# EAGLE design usb-conn (EAGLE 8.3.1)
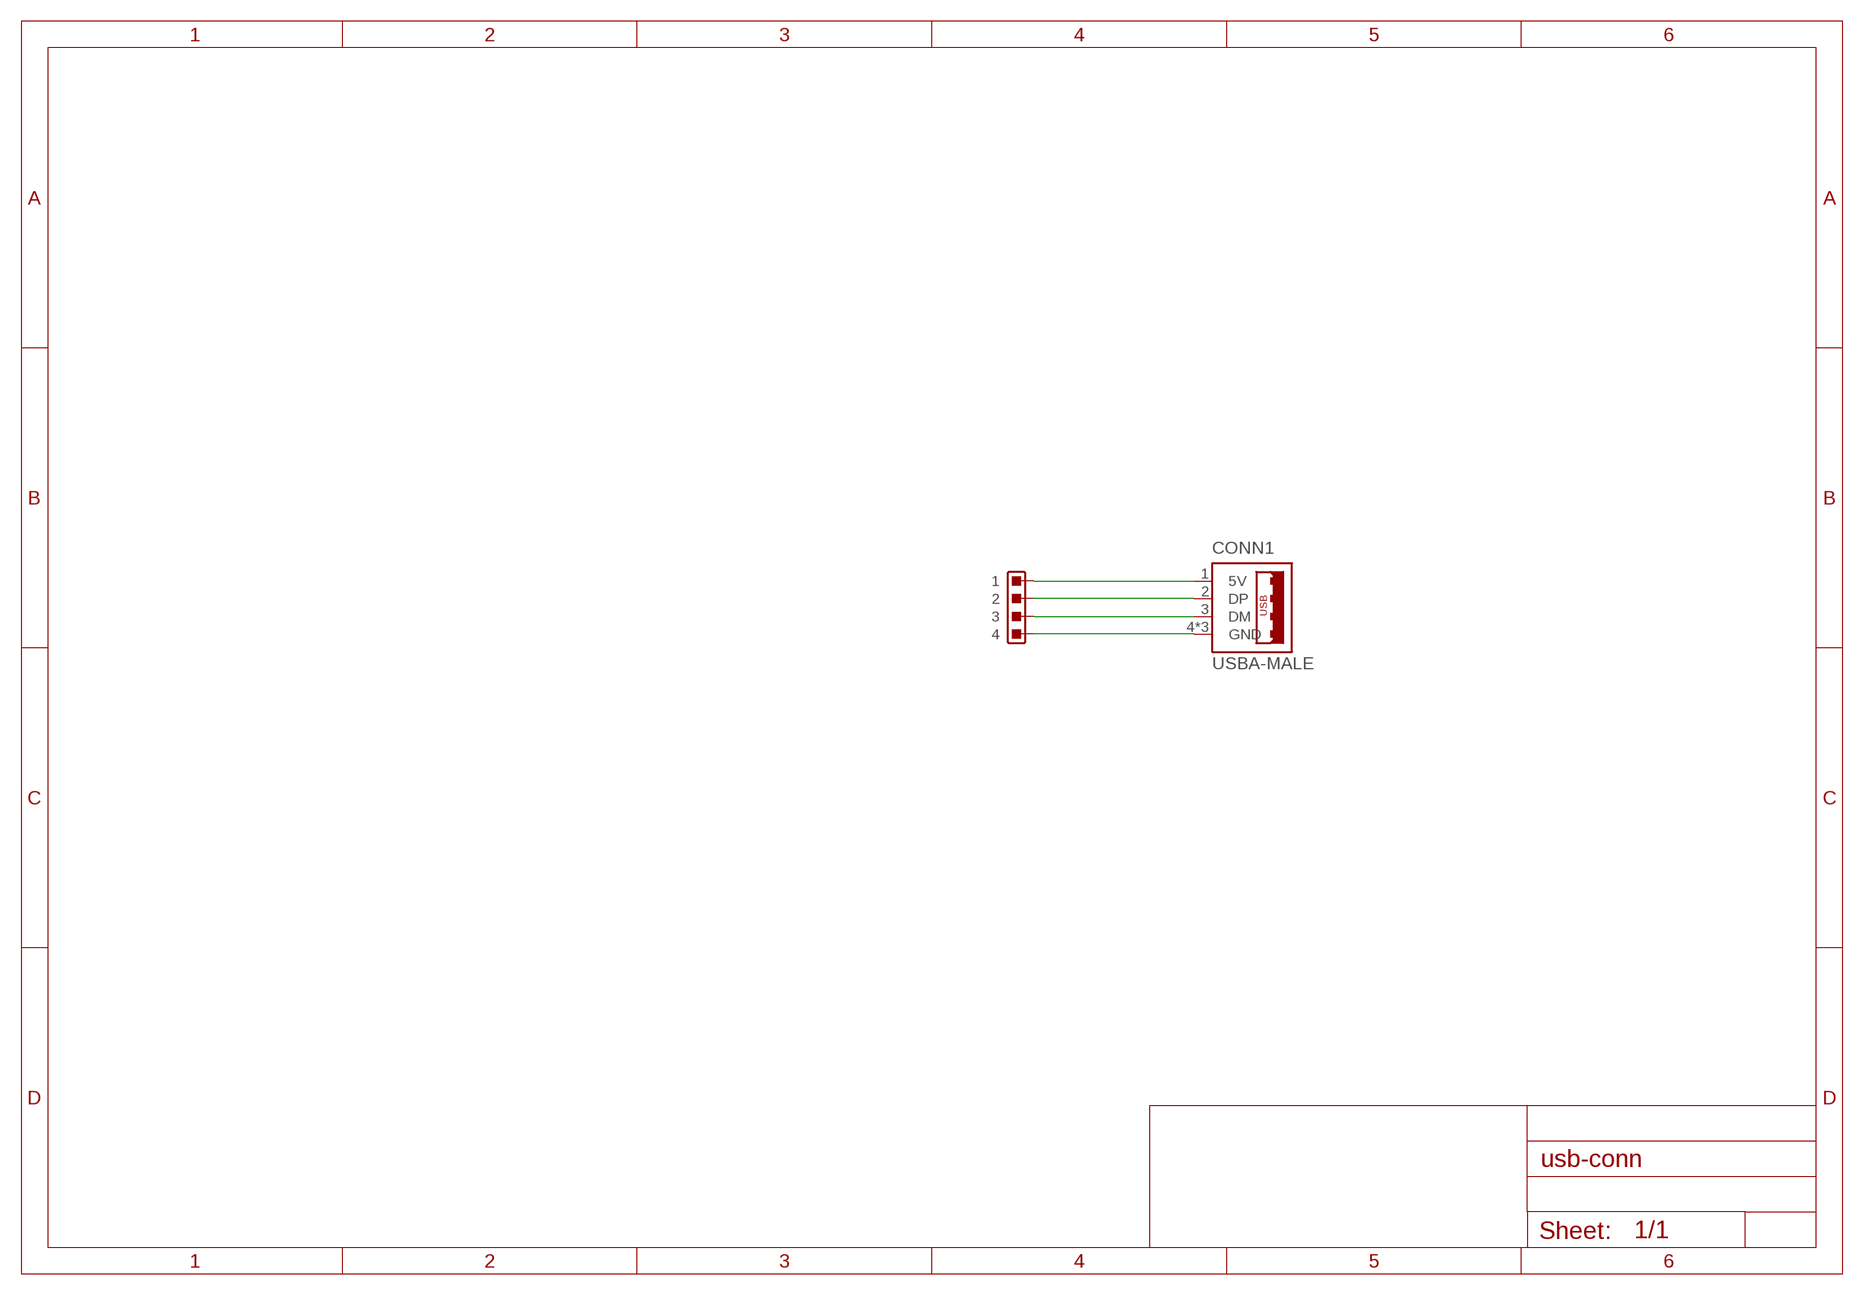
[diagram p0: schematic, sheet 1]

## Parts
CONN1  USBA-MALE  [USBA-MALE]
U$1  4PINCONNMALE  [4PINCONN-MALE]

## Nets
5V: CONN1.1(5V) U$1.1@1 U$1.1@2
DM: CONN1.3(DM) U$1.3@1 U$1.3@2
DP: CONN1.2(DP) U$1.2@1 U$1.2@2
GND: CONN1.4(GND) CONN1.GND$1(GND) CONN1.GND$2(GND) U$1.4@1 U$1.4@2

## Library data of the parts
CONN1 = tuetuopay:USBA-MALE
U$1 = tuetuopay:4PINCONN

## Board
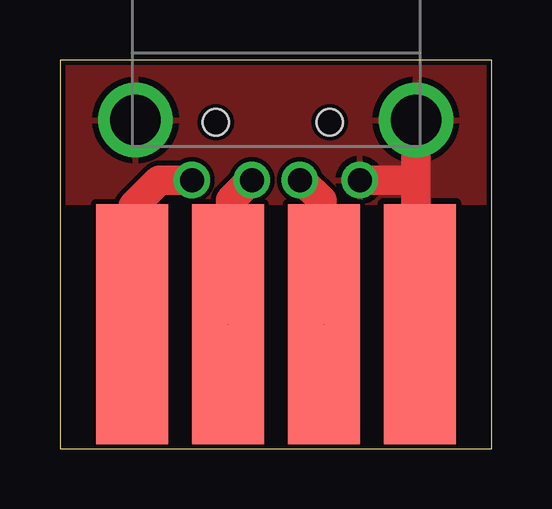
[diagram p1: board, top side]
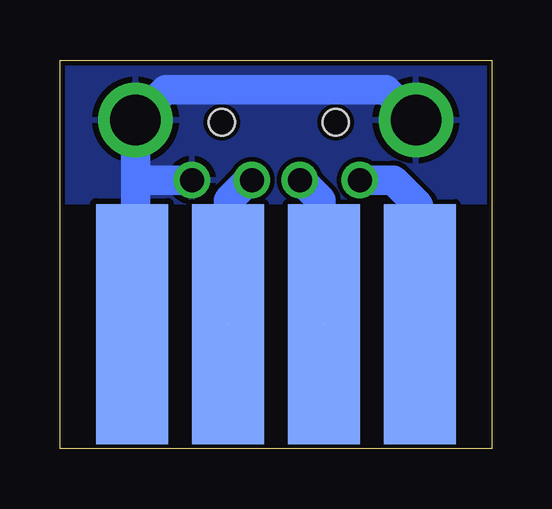
[diagram p2: board, bottom side, seen from below]

Size 18 x 16.2 mm. Coordinates in mm from the lower left corner, seen from the top.
Outline: 0,0 18,0 18,16.2 0,16.2 0,0
Copper layers (1*16): Top 0.035mm / dielectric 1.5mm / Bottom 0.035mm
Design rules "default *": minimum track width 6mil, minimum drill 0.35mm, track to track 8mil, track to pad 6mil, pad to pad 6mil, via to via 6mil, smd to smd 6mil, copper to edge 8mil, drill to drill 6mil, minimum pad ring 10mil, minimum via ring 8mil, stop-mask expansion 4mil, vias tented up to drill 0mil, thermal gap 10mil

### Footprints (pad centres in the part's own frame; a part is rotated, then mirrored left to right if it is on the bottom)
USBA-MALE = drill 1: 1 -3.5,0; 2 -1,0; 3 1,0; 4 3.5,0 | drill 2.1: GND$1 -5.85,2.5; GND$2 5.85,2.5 | hole 1.1: 2.25,2.4; -2.5,2.4
4PINCONN-MALE = smd 3 x 10: 1@1 2,5; 2@1 6,5; 3@1 10,5; 4@1 14,5 | smd 3 x 10 bottom: 1@2 2,5; 2@2 6,5; 3@2 10,5; 4@2 14,5

### Placement (x,y rotation side)
CONN1  9,11.2 0 top
U$1  1,0.2 0 top

### Tracks (layer width: path | path; a pad name or v marks a point on that pad's centre or on a via)
5V
  Top 1.219: CONN1.1 4.14,11.2 3.05,10.11 3.05,9.25 | 3.05,9.25 3,9.2 | 3,7.2 U$1.1@2 3,7.2 | 3,7.2 3,9.2 | 3,9.2 3.05,9.25
  Bottom 1.219: CONN1.1 4.09,11.2 3.05,10.16 3.05,5.25 U$1.1@2
DM  (1 unrouted)
  Top 1.219: CONN1.3 10.08,11.2 10.92,10.36 10.92,9.28 11,9.2 | U$1.3@2 11,7.2
  Bottom 1.219: CONN1.3 10.13,11.2 10.97,10.36 10.97,5.23 U$1.3@2
DP  (1 unrouted)
  Top 1.219: CONN1.2 7.95,11.2 7.11,10.36 7.11,9.32 7,9.2 | 7,7.2 U$1.2@2
  Bottom 1.219: CONN1.2 7.95,11.2 7.11,10.36 7.11,5.32 U$1.2@2
GND
  Top 1.219: U$1.4@2 15,7.2 14.85,7.35 14.85,11.22 | CONN1.GND$2 14.85,11.22 | CONN1.4 14.83,11.2 14.85,11.22
  Bottom 1.219: U$1.4@2 14.83,5.37 14.83,10.36 14.85,10.38 14.85,11.28 | 14.85,11.28 CONN1.GND$2 13.59,14.97 4.41,14.97 CONN1.GND$1 | 14.85,11.28 14.77,11.2 CONN1.4
  pour Bottom: 0,16.2 0,10.2 18,10.2 18,16.2
  pour Top: 0,16.2 0,10.2 18,10.2 18,16.2